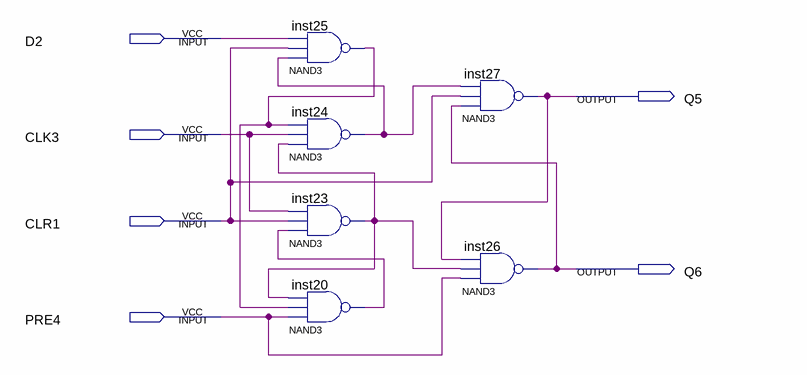
[diagram p0: schematic sheet]
// Quartus schematic 74LS74a.bdf as structural Verilog: 6 symbols, 6 pins
module \74LS74a  (
  input  D2,
  input  CLK3,
  input  CLR1,
  input  PRE4,
  output Q5,
  output Q6
);

  wire inst20_out, inst23_out, inst24_out, inst25_out;

  nand inst25 (inst25_out, inst24_out, CLR1, D2);
  nand inst24 (inst24_out, inst23_out, CLK3, inst25_out);
  nand inst23 (inst23_out, inst20_out, CLR1, CLK3);
  nand inst20 (inst20_out, PRE4, inst25_out, inst23_out);
  nand inst27 (Q5, Q6, CLR1, inst24_out);
  nand inst26 (Q6, PRE4, inst23_out, Q5);
endmodule
